# Altium schematic sheet Unused Schematics.SchDoc
size A; SheetNumber: 7; SheetTotal: 7
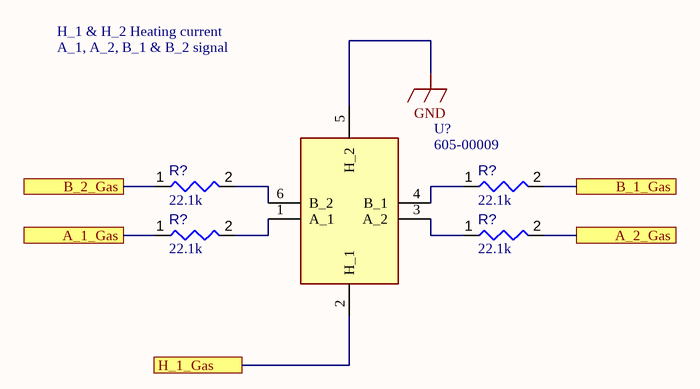
[diagram p0: Unused Schematics.SchDoc]

## Parts
(Parts that share a designator on the sheet are numbered #1, #2 ... from top to bottom, then left to right.)
R?#1  value 22.1k  [RESA60-630X240]  (hidden comment: MFR-25FBF52-22K1)
R?#2  value 22.1k  [RESA60-630X240]  (hidden comment: MFR-25FBF52-22K1)
R?#3  value 22.1k  [RESA60-630X240]  (hidden comment: MFR-25FBF52-22K1)
R?#4  value 22.1k  [RESA60-630X240]  (hidden comment: MFR-25FBF52-22K1)
U?  605-00009  [60500009]

## Ports
A_1_Gas, A_2_Gas, B_1_Gas, B_2_Gas, H_1_Gas

## Nets
GND: U?.5(H_2)
A_1_Gas: R?#3.1 ; port A_1_Gas
A_2_Gas: R?#4.2 ; port A_2_Gas
B_1_Gas: R?#2.2 ; port B_1_Gas
B_2_Gas: R?#1.1 ; port B_2_Gas
H_1_Gas: U?.2(H_1) ; port H_1_Gas
NetR?#1_2: R?#1.2 U?.6(B_2)
NetR?#2_1: R?#2.1 U?.4(B_1)
NetR?#3_2: R?#3.2 U?.1(A_1)
NetR?#4_1: R?#4.1 U?.3(A_2)

## Notes on the sheet
- H_1 & H_2 Heating current
- A_1, A_2, B_1 & B_2 signal

## Library data of the parts
R?#1-R?#4 = CMP-009-00052-4: Axial Resistor, 22.1 KOhm, +/- 1%, 0.25 W, -55 to 155 degC, 2-Pin THD, RoHS, Bulk; Manufacturer: Yageo; Power: 250mW; Voltage Rating: 250V; Packaging: Bulk; Max Operating Temperature: 155°C; Case/Package: Axial; Tolerance: 1%; Mounting Technology: TH; Min Operating Temperature: -55°C; RoHS Compliant: True; Package Quantity: 200; Package Reference: MFR-25; Manufacturer URL: http://www.yageo.com/; Package Description: 2-Pin Axial Lead, Dia 2.4 mm, Body Length 6.3 mm; Datasheet Version: Apr-13; Datasheet URL: http://www.yageo.com/documents/recent/Yageo%20LR_MFR_2013.pdf
U? = 605-00009: Undefined or Miscellaneous; Manufacturer_Name: Parallax; Datasheet Link: https://datasheet.datasheetarchive.com/originals/distributors/DKDS-18/349907.pdf; Height: 10mm; Manufacturer_Part_Number: 605-00009; Mouser Part Number: 619-605-00009; Mouser Price/Stock: https://www.mouser.co.uk/ProductDetail/Parallax/605-00009?qs=c8dSG9xvwkc3Fl0aFi4nyw%3D%3D